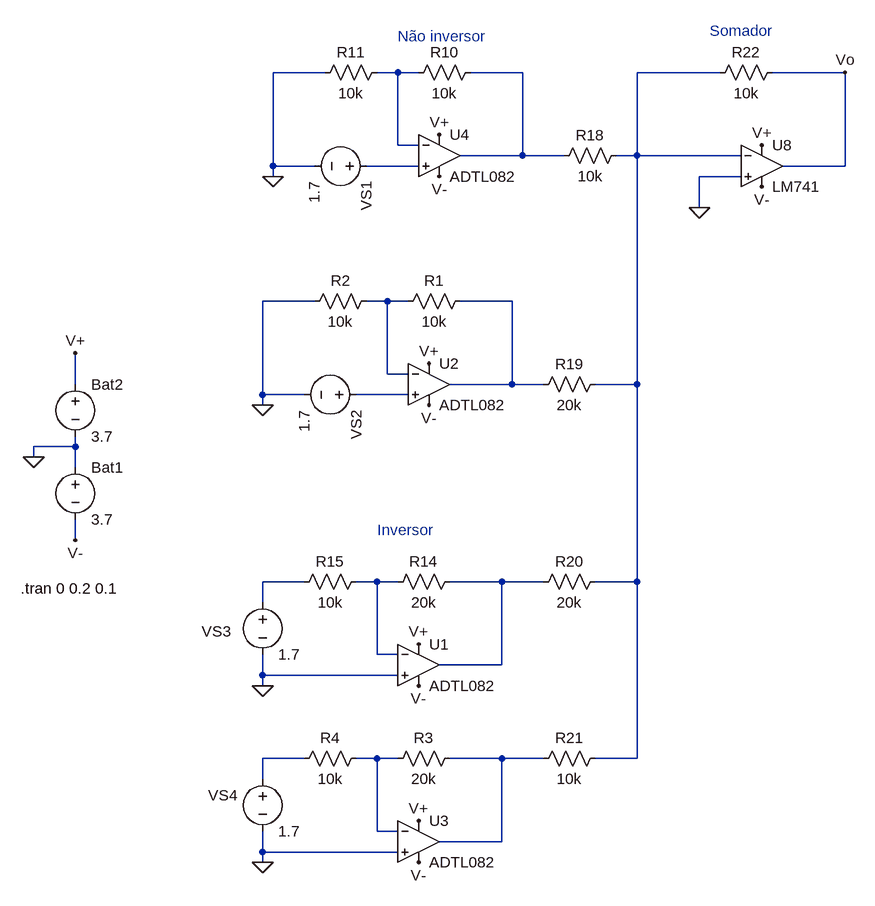
[diagram p0: schematic Sensores.asc]
Sensores.asc, the LTspice schematic file:
Version 4
SHEET 1 880 1364
WIRE -1488 64 -1568 64
WIRE -1376 64 -1408 64
WIRE -1344 64 -1376 64
WIRE -1184 64 -1264 64
WIRE -880 64 -1008 64
WIRE -688 64 -800 64
WIRE -1376 176 -1376 64
WIRE -1344 176 -1376 176
WIRE -1184 192 -1184 64
WIRE -1184 192 -1280 192
WIRE -1120 192 -1184 192
WIRE -1008 192 -1008 64
WIRE -1008 192 -1040 192
WIRE -848 192 -1008 192
WIRE -1568 208 -1568 64
WIRE -1504 208 -1568 208
WIRE -1344 208 -1424 208
WIRE -688 208 -688 64
WIRE -688 208 -784 208
WIRE -1568 224 -1568 208
WIRE -848 224 -912 224
WIRE -912 272 -912 224
WIRE -1504 416 -1584 416
WIRE -1392 416 -1424 416
WIRE -1360 416 -1392 416
WIRE -1200 416 -1280 416
WIRE -1392 528 -1392 416
WIRE -1360 528 -1392 528
WIRE -1872 544 -1872 496
WIRE -1200 544 -1200 416
WIRE -1200 544 -1296 544
WIRE -1152 544 -1200 544
WIRE -1008 544 -1008 192
WIRE -1008 544 -1072 544
WIRE -1584 560 -1584 416
WIRE -1520 560 -1584 560
WIRE -1360 560 -1440 560
WIRE -1584 576 -1584 560
WIRE -1872 640 -1872 624
WIRE -1872 640 -1936 640
WIRE -1936 656 -1936 640
WIRE -1872 672 -1872 640
WIRE -1872 784 -1872 752
WIRE -1520 848 -1584 848
WIRE -1408 848 -1440 848
WIRE -1376 848 -1408 848
WIRE -1216 848 -1296 848
WIRE -1152 848 -1216 848
WIRE -1008 848 -1008 544
WIRE -1008 848 -1072 848
WIRE -1584 880 -1584 848
WIRE -1408 960 -1408 848
WIRE -1376 960 -1408 960
WIRE -1216 976 -1216 848
WIRE -1216 976 -1312 976
WIRE -1584 992 -1584 960
WIRE -1376 992 -1584 992
WIRE -1584 1008 -1584 992
WIRE -1520 1120 -1584 1120
WIRE -1408 1120 -1440 1120
WIRE -1376 1120 -1408 1120
WIRE -1216 1120 -1296 1120
WIRE -1152 1120 -1216 1120
WIRE -1008 1120 -1008 848
WIRE -1008 1120 -1072 1120
WIRE -1584 1152 -1584 1120
WIRE -1408 1232 -1408 1120
WIRE -1376 1232 -1408 1232
WIRE -1216 1248 -1216 1120
WIRE -1216 1248 -1312 1248
WIRE -1584 1264 -1584 1232
WIRE -1376 1264 -1584 1264
WIRE -1584 1280 -1584 1264
FLAG -1872 496 V+
FLAG -1936 656 0
FLAG -1872 784 V-
FLAG -1312 160 V+
FLAG -1312 224 V-
FLAG -1344 944 V+
FLAG -1344 1008 V-
FLAG -816 176 V+
FLAG -816 240 V-
FLAG -912 272 0
FLAG -688 64 Vo
FLAG -1568 224 0
FLAG -1328 512 V+
FLAG -1328 576 V-
FLAG -1584 576 0
FLAG -1584 1008 0
FLAG -1344 1216 V+
FLAG -1344 1280 V-
FLAG -1584 1280 0
SYMBOL voltage -1872 656 R0
SYMATTR InstName Bat1
SYMATTR Value 3.7
SYMBOL voltage -1872 528 R0
SYMATTR InstName Bat2
SYMATTR Value 3.7
SYMBOL voltage -1408 208 R90
WINDOW 123 0 0 Left 0
WINDOW 39 0 0 Left 0
SYMATTR InstName VS1
SYMATTR Value 1.7
SYMBOL res -1248 48 R90
WINDOW 0 0 56 VBottom 2
WINDOW 3 32 56 VTop 2
SYMATTR InstName R10
SYMATTR Value 10k
SYMBOL res -1392 48 R90
WINDOW 0 0 56 VBottom 2
WINDOW 3 32 56 VTop 2
SYMATTR InstName R11
SYMATTR Value 10k
SYMBOL voltage -1584 864 R0
WINDOW 123 0 0 Left 0
WINDOW 39 0 0 Left 0
WINDOW 0 -94 60 Left 2
SYMATTR InstName VS3
SYMATTR Value 1.7
SYMBOL res -1280 832 R90
WINDOW 0 0 56 VBottom 2
WINDOW 3 32 56 VTop 2
SYMATTR InstName R14
SYMATTR Value 20k
SYMBOL res -1424 832 R90
WINDOW 0 0 56 VBottom 2
WINDOW 3 32 56 VTop 2
SYMATTR InstName R15
SYMATTR Value 10k
SYMBOL res -1024 176 R90
WINDOW 0 0 56 VBottom 2
WINDOW 3 32 56 VTop 2
SYMATTR InstName R18
SYMATTR Value 10k
SYMBOL res -1056 528 R90
WINDOW 0 0 56 VBottom 2
WINDOW 3 32 56 VTop 2
SYMATTR InstName R19
SYMATTR Value 20k
SYMBOL res -1056 832 R90
WINDOW 0 0 56 VBottom 2
WINDOW 3 32 56 VTop 2
SYMATTR InstName R20
SYMATTR Value 20k
SYMBOL res -1056 1104 R90
WINDOW 0 0 56 VBottom 2
WINDOW 3 32 56 VTop 2
SYMATTR InstName R21
SYMATTR Value 10k
SYMBOL OpAmps\\LM741 -816 144 R0
SYMATTR InstName U8
SYMBOL res -784 48 R90
WINDOW 0 0 56 VBottom 2
WINDOW 3 32 56 VTop 2
SYMATTR InstName R22
SYMATTR Value 10k
SYMBOL voltage -1424 560 R90
WINDOW 123 0 0 Left 0
WINDOW 39 0 0 Left 0
SYMATTR InstName VS2
SYMATTR Value 1.7
SYMBOL res -1264 400 R90
WINDOW 0 0 56 VBottom 2
WINDOW 3 32 56 VTop 2
SYMATTR InstName R1
SYMATTR Value 10k
SYMBOL res -1408 400 R90
WINDOW 0 0 56 VBottom 2
WINDOW 3 32 56 VTop 2
SYMATTR InstName R2
SYMATTR Value 10k
SYMBOL voltage -1584 1136 R0
WINDOW 123 0 0 Left 0
WINDOW 39 0 0 Left 0
WINDOW 0 -84 41 Left 2
SYMATTR InstName VS4
SYMATTR Value 1.7
SYMBOL res -1280 1104 R90
WINDOW 0 0 56 VBottom 2
WINDOW 3 32 56 VTop 2
SYMATTR InstName R3
SYMATTR Value 20k
SYMBOL res -1424 1104 R90
WINDOW 0 0 56 VBottom 2
WINDOW 3 32 56 VTop 2
SYMATTR InstName R4
SYMATTR Value 10k
SYMBOL OpAmps\\ADTL082 -1344 1184 R0
SYMATTR InstName U3
SYMBOL OpAmps\\ADTL082 -1344 912 R0
SYMATTR InstName U1
SYMBOL OpAmps\\ADTL082 -1328 480 R0
SYMATTR InstName U2
SYMBOL OpAmps\\ADTL082 -1312 128 R0
SYMATTR InstName U4
TEXT -1956 858 Left 2 !.tran 0 0.2 0.1
TEXT -1408 768 Left 2 ;Inversor
TEXT -1376 8 Left 2 ;Não inversor
TEXT -896 0 Left 2 ;Somador

The netlist it stands for:
* Sensores.asc
V§Bat1 0 V- 3.7
V§Bat2 V+ 0 3.7
VS1 N004 0 1.7
R10 N002 N001 10k
R11 N001 0 10k
VS3 N008 0 1.7
R14 N010 N009 20k
R15 N009 N008 10k
R18 N003 N002 10k
R19 N003 N006 20k
R20 N003 N010 20k
R21 N003 N013 10k
XU8 0 N003 V+ V- Vo LM741  ; pins In+ In- V+ V- OUT
R22 Vo N003 10k
VS2 N007 0 1.7
R1 N006 N005 10k
R2 N005 0 10k
VS4 N011 0 1.7
R3 N013 N012 20k
R4 N012 N011 10k
XU3 0 N012 V+ V- N013 ADTL082  ; pins In+ In- V+ V- OUT
XU1 0 N009 V+ V- N010 ADTL082  ; pins In+ In- V+ V- OUT
XU2 N007 N005 V+ V- N006 ADTL082  ; pins In+ In- V+ V- OUT
XU4 N004 N001 V+ V- N002 ADTL082  ; pins In+ In- V+ V- OUT
.tran 0 0.2 0.1
* Inversor
* Não inversor
* Somador
.lib LM741.lib
.lib ADI.lib
.backanno
.end